# EAGLE schematic C2_Servos (EAGLE 6.4)
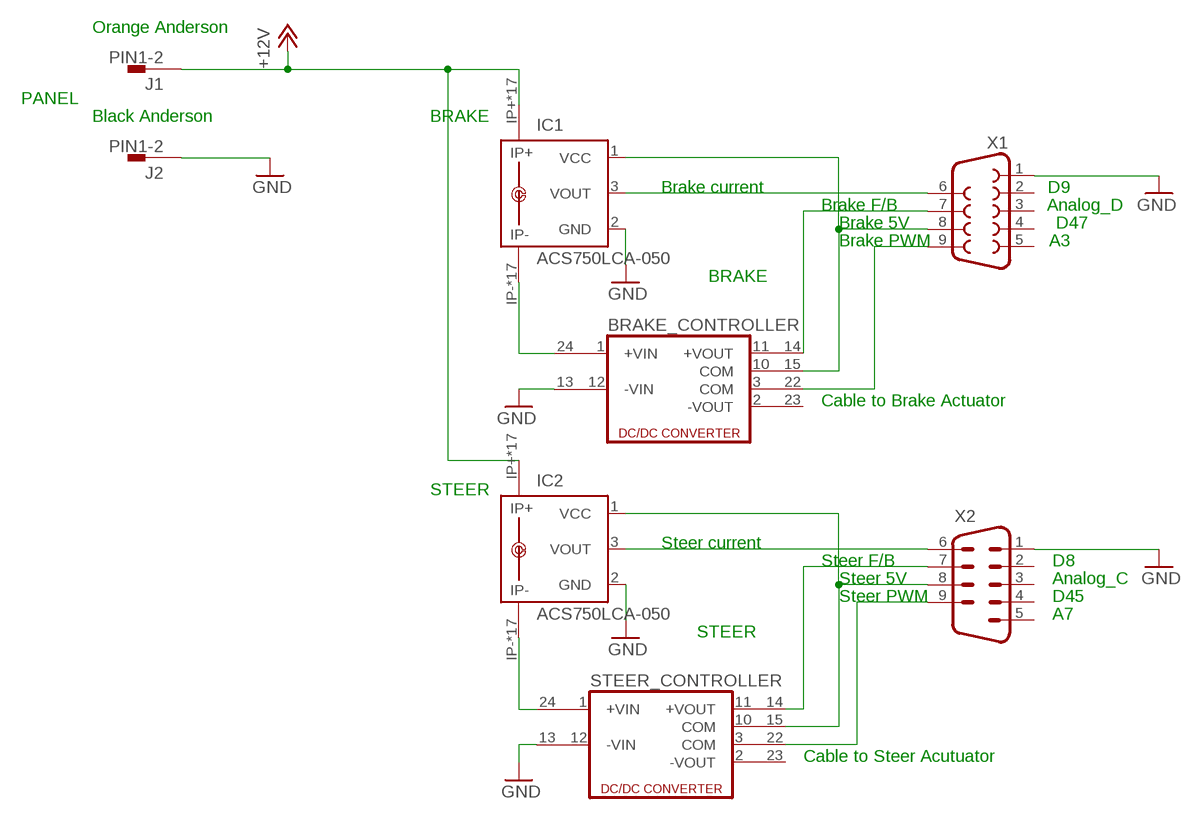
[diagram p0: schematic, sheet 1]

## Parts
BRAKE_CONTROLLER  DCW2C  [DCW]
IC1  ACS750LCA-050  [ACS75050]
IC2  ACS750LCA-050  [ACS75050]
J1  PIN1-2  [62221]
J2  PIN1-2  [62221]
STEER_CONTROLLER  DCW2C  [DCW]
X1  F09H  [F09H]
X2  M09-182  [182-009-MALE]

## Nets
+12V: IC1.IP+ IC1.IP+@2(IP+) IC1.IP+@3(IP+) IC1.IP+@4(IP+) IC1.IP+@5(IP+) IC1.IP+@6(IP+) IC1.IP+@7(IP+) IC1.IP+@8(IP+) IC1.IP+@9(IP+) IC1.IP+@10(IP+) IC1.IP+@11(IP+) IC1.IP+@12(IP+) IC1.IP+@13(IP+) IC1.IP+@14(IP+) IC1.IP+@15(IP+) IC1.IP+@16(IP+) IC1.IP+@17(IP+) IC2.IP+ IC2.IP+@2(IP+) IC2.IP+@3(IP+) IC2.IP+@4(IP+) IC2.IP+@5(IP+) IC2.IP+@6(IP+) IC2.IP+@7(IP+) IC2.IP+@8(IP+) IC2.IP+@9(IP+) IC2.IP+@10(IP+) IC2.IP+@11(IP+) IC2.IP+@12(IP+) IC2.IP+@13(IP+) IC2.IP+@14(IP+) IC2.IP+@15(IP+) IC2.IP+@16(IP+) IC2.IP+@17(IP+) J1.1
GND: BRAKE_CONTROLLER.13(-VIN1) IC1.2(GND) IC2.2(GND) J2.1 STEER_CONTROLLER.13(-VIN1) X1.1 X2.1
N$1: IC1.3(VOUT) X1.6
N$2: BRAKE_CONTROLLER.15(COM1) IC1.1(VCC) X1.8
N$3: IC2.3(VOUT) X2.6
N$4: IC2.IP- IC2.IP-@2(IP-) IC2.IP-@3(IP-) IC2.IP-@4(IP-) IC2.IP-@5(IP-) IC2.IP-@6(IP-) IC2.IP-@7(IP-) IC2.IP-@8(IP-) IC2.IP-@9(IP-) IC2.IP-@10(IP-) IC2.IP-@11(IP-) IC2.IP-@12(IP-) IC2.IP-@13(IP-) IC2.IP-@14(IP-) IC2.IP-@15(IP-) IC2.IP-@16(IP-) IC2.IP-@17(IP-) STEER_CONTROLLER.24(+VIN1)
N$5: STEER_CONTROLLER.22(COM2) X2.9
N$6: IC2.1(VCC) STEER_CONTROLLER.15(COM1) X2.8
N$7: STEER_CONTROLLER.14(+VOUT1) X2.7
N$8: BRAKE_CONTROLLER.24(+VIN1) IC1.IP- IC1.IP-@2(IP-) IC1.IP-@3(IP-) IC1.IP-@4(IP-) IC1.IP-@5(IP-) IC1.IP-@6(IP-) IC1.IP-@7(IP-) IC1.IP-@8(IP-) IC1.IP-@9(IP-) IC1.IP-@10(IP-) IC1.IP-@11(IP-) IC1.IP-@12(IP-) IC1.IP-@13(IP-) IC1.IP-@14(IP-) IC1.IP-@15(IP-) IC1.IP-@16(IP-) IC1.IP-@17(IP-)
N$9: BRAKE_CONTROLLER.22(COM2) X1.9
N$10: BRAKE_CONTROLLER.14(+VOUT1) X1.7
Unconnected: BRAKE_CONTROLLER.1(+VIN) BRAKE_CONTROLLER.2(-VOUT) BRAKE_CONTROLLER.3(COM) BRAKE_CONTROLLER.10(COM) BRAKE_CONTROLLER.11(+VOUT) BRAKE_CONTROLLER.12(-VIN) BRAKE_CONTROLLER.23(-VOUT1) STEER_CONTROLLER.1(+VIN) STEER_CONTROLLER.2(-VOUT) STEER_CONTROLLER.3(COM) STEER_CONTROLLER.10(COM) STEER_CONTROLLER.11(+VOUT) STEER_CONTROLLER.12(-VIN) STEER_CONTROLLER.23(-VOUT1) X1.2 X1.3 X1.4 X1.5 X2.2 X2.3 X2.4 X2.5

## Notes on the sheet
- Orange Anderson
- PANEL
- Black Anderson | BRAKE
- Brake current | D9
- Brake F/B | Analog_D
- Brake 5V | D47
- Brake PWM | A3
- BRAKE
- Cable to Brake Actuator
- STEER
- Steer current
- Steer F/B | D8
- Steer 5V | Analog_C
- Steer PWM | D45
- A7
- STEER
- Cable to Steer Acutuator

## Library data of the parts
BRAKE_CONTROLLER STEER_CONTROLLER = dc-dc-converter:DCW2C: DC-DC CONVERTER; OC_FARNELL: unknown; OC_NEWARK: unknown
IC1 IC2 = allegro:ACS750*CA-050: Current Sensor display layer 49 Reference in BRD and place VIAs on circles Source: www.allegromicro.com/datafile/0750-050.pdf; MF: ALLEGRO MICROSYSTEMS, INC.; MPN: ACS750LCA-050; OC_FARNELL: 1457176; OC_NEWARK: 61H4464
J1 J2 = con-faston:PIN1-2: CONN TAB FASTON BRASS .187 PCB TAB, FSSTON, DUAL STAKE, .187 SERIES Digi-Key Part Number: A24734CT-ND Source: Tyco Electronics Corporation .. ENG_CD_62221_R.pdf http://search.digikey.com/scripts/DkSearch/dksus.dll?Detail&name=A24734CT-ND; MF: TYCO ELECTRONICS; MPN: 62221-1; OC_FARNELL: unknown; OC_NEWARK: 16H2318
X1 = con-subd:F09: SUB-D; OC_FARNELL: unknown; OC_NEWARK: unknown
X2 = con-subd:M09: SUB-D; OC_FARNELL: unknown; OC_NEWARK: unknown